# Altium schematic sheet POWER.SchDoc
size 513 x 304 mm
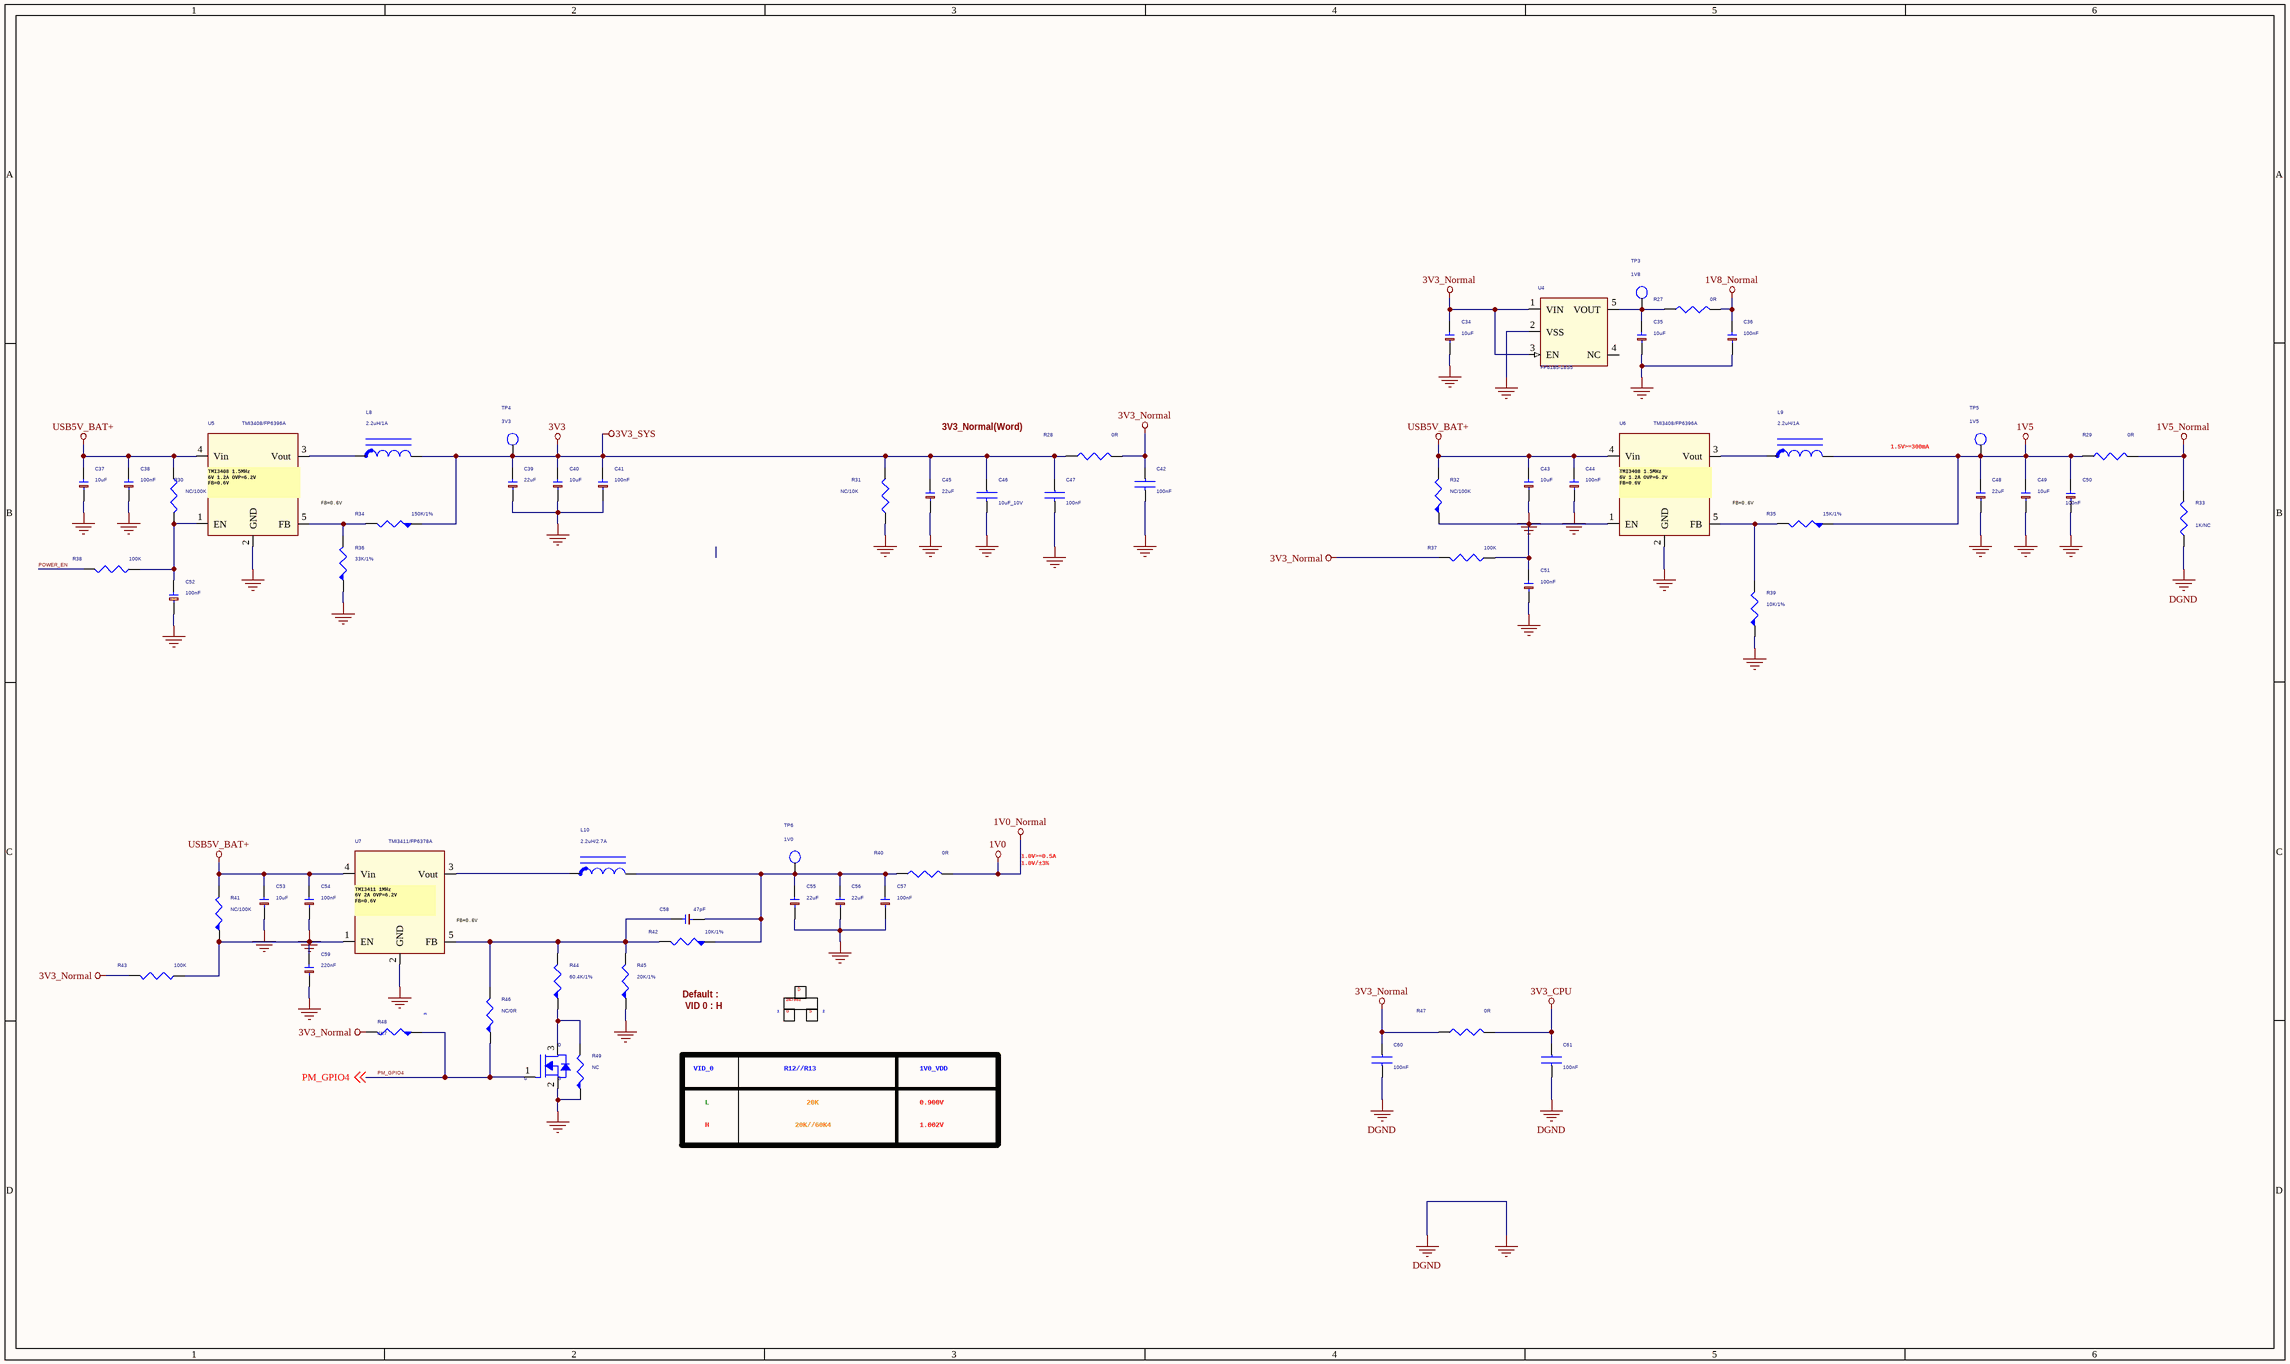
[diagram p0: POWER.SchDoc]

## Parts
C34  10uF  [C0402]
C35  10uF  [C0402]
C36  100nF  [C0402]
C37  10uF  [C0402]
C38  100nF  [C0402]
C39  22uF  [C0402]
C40  10uF  [C0402]
C41  100nF  [C0402]
C42  100nF  [C0402]
C43  10uF  [C0402]
C44  100nF  [C0402]
C45  22uF  [C0402]
C46  10uF_10V  [C0603]
C47  100nF  [C0402]
C48  22uF  [C0402]
C49  10uF  [C0402]
C50  100nF  [C0402]
C51  100nF  [C0402]
C52  100nF  [C0402]
C53  10uF  [C0402]
C54  100nF  [C0402]
C55  22uF  [C0402]
C56  22uF  [C0402]
C57  100nF  [C0402]
C58  47pF  [C0402]
C59  220nF  [C0402]
C60  100nF  [C0402]
C61  100nF  [C0402]
L8  2.2uH/1A  [SWPA3015S]
L9  2.2uH/1A  [SWPA3015S]
L10  2.2uH/2.7A  [L-MLPS-4018]
Q4  2N7002  [SOT-23]  (value not drawn)
R27  0R  [R0402]
R28  0R  [R1210]
R29  0R  [R1210]
R30  NC/100K  [R0402]
R31  NC/10K  [R0402]
R32  NC/100K  [R0402]
R33  1K/NC  [R0402]
R34  150K/1%  [R0402]
R35  15K/1%  [R0402]
R36  33K/1%  [R0402]
R37  100K  [R0402]
R38  100K  [R0402]
R39  10K/1%  [R0402]
R40  0R  [R1210]
R41  NC/100K  [R0402]
R42  10K/1%  [R0402]
R43  100K  [R0402]
R44  60.4K/1%  [R0402]
R45  20K/1%  [R0402]
R46  NC/0R  [R0402]
R47  0R  [R1210]
R48  4K7  [R0402]
R49  NC  [R0402]
TP3  1V8  [TP]
TP4  3V3  [TP]
TP5  1V5  [TP]
TP6  1V0  [TP]
U4  FP6185-18S5  [SOT23-5P]
U5  TMI3408/FP6396A  [SOT-23-5]
U6  TMI3408/FP6396A  [SOT-23-5]
U7  TMI3411/FP6378A  [SOT-23-5]

## Nets
1V0: R40.2  [also labelled 1V0_Normal]
1V5: C48.2 C49.2 C50.1 L9.2 R29.1 R35.1 TP5.1(TP)
1V5_Normal: R29.2 R33.1
1V8_Normal: C36.2 R27.2
3V3: C39.2 C40.2 C41.2 C45.2 C46.1 C47.1 L8.2 R28.1 R31.1 R34.1 TP4.1(TP)  [also labelled 3V3_SYS]
3V3_CPU: C61.1 R47.2
3V3_Normal: C34.2 C42.1 C60.1 R28.2 R37.2 R43.1 R47.1 R48.2 U4.1(VIN) U4.3(EN)
DGND: C34.1 C35.1 C36.1 C37.1 C38.1 C39.1 C40.1 C41.1 C42.2 C43.1 C44.1 C45.1 C46.2 C47.2 C48.1 C49.1 C50.2 C51.1 C52.1 C53.1 C54.1 C55.1 C56.1 C57.1 C59.1 C60.2 C61.2 Q4.2(SOURCE) R31.2 R33.2 R36.1 R39.1 R45.1 R49.1 U4.2(VSS) U5.2(GND) U6.2(GND) U7.2(GND)  [also labelled GND]
USB5V_BAT+: C37.2 C38.2 C43.2 C44.2 C53.2 C54.2 R30.2 R32.2 R41.2 U5.4(Vin) U6.4(Vin) U7.4(Vin)
PM_GPIO4: Q4.1(GATE) R46.1 R48.1 ; off-sheet PM_GPIO4
POWER_EN: R38.2
NetC35_2: C35.2 R27.1 TP3.1(TP) U4.5(VOUT)
NetC51_2: C51.2 R32.1 R37.1 U6.1(EN)
NetC52_2: C52.2 R30.1 R38.1 U5.1(EN)
NetC55_2: C55.2 C56.2 C57.2 C58.1 L10.2 R40.1 R42.1 TP6.1(TP)
NetC58_2: C58.2 R42.2 R44.2 R45.2 R46.2 U7.5(FB)
NetC59_2: C59.2 R41.1 R43.2 U7.1(EN)
NetL8_1: L8.1 U5.3(Vout)
NetL9_1: L9.1 U6.3(Vout)
NetL10_1: L10.1 U7.3(Vout)
NetQ4_3: Q4.3(DRAIN) R44.1 R49.2
NetR34_2: R34.2 R36.2 U5.5(FB)
NetR35_2: R35.2 R39.2 U6.5(FB)

Not connected (* = marked no-connect by the designer): U4 4(NC)

## Notes on the sheet
- 3V3_Normal(Word)
- 1.5V>=300mA
- (near U5) FB=0.6V
- (near U6) FB=0.6V
- 1.0V>=0.5A
  1.0V/±3%
- (near U7) FB=0.6V
- (near R48) 3
- Default :
  VID 0 : H
- 1
- G
- 2N7002
- D
- S
- 2
- VID_0
- R12//R13
- 1V0_VDD
- L
- H
- 20K//60K4
- 20K
- 1.002V
- 0.900V
- (in symbol AO3400_SOT23) D; G; S
- (in symbol LDO,iD9306-AD,300mA_3) TMI3408 1.5MHz / 6V 1.2A OVP=6.2V / FB=0.6V /
- (in symbol LDO,iD9306-AD,300mA_4) TMI3411 1MHz / 6V 2A OVP=6.2V / FB=0.6V /

## Library data of the parts
C34-C41 C43-C45 C48 C49 C51-C59 = C0402/100nF/10V/X7R: [ 100nF(0.1uF),10V,X7R ](0402); Part Name: 0402B104K100C; Brand: Walsin地穝; Class: Capacitor; Creator: Alan.Liu#6135/0920796617
C42 C46 C47 C60 C61 = CAP NP2
C50 = C0805_10uF: Class: DISCRETE
L8-L10 = CHOKE_4.7uH/4.1A-L8.0W8.0H4.0: [ 4.7uH/4100mA ]; Inductance:4.7uH+-30%;Rated Current:4100mA;Self-resonant Frequency:30MHz;DC.Resistance:0.018R+-30%;; Part Name: NR8040T4R7N; Class: Choke; Brand: TAIYO YUDENび锭护筿; Creator: Alan.Liu#6135/0920796617
Q4 = AO3400_SOT23: BOM: N-Channel EMFET 2N7002 SOT23 <FAIRCHILD>; COST(NT$): 4.69
R27 = R_Dup1
R28-R31 R33 R37 R38 R40 R43 R47 = R_Dup2
R32 R34-R36 R39 R41 R42 R44-R46 R48 R49 = R-PIN-Mark
TP3-TP6 = T POINT R
U4 = ADP1610_7
U5 U6 = LDO,iD9306-AD,300mA_3: iD9306-AD; Part Number: 300035100G; Specification: SOT23,1.8V,ROHS
U7 = LDO,iD9306-AD,300mA_4: iD9306-AD; Part Number: 300035100G; Specification: SOT23,1.8V,ROHS